# Altium schematic sheet OBD.SchDoc (part 1 of 3)
size A3
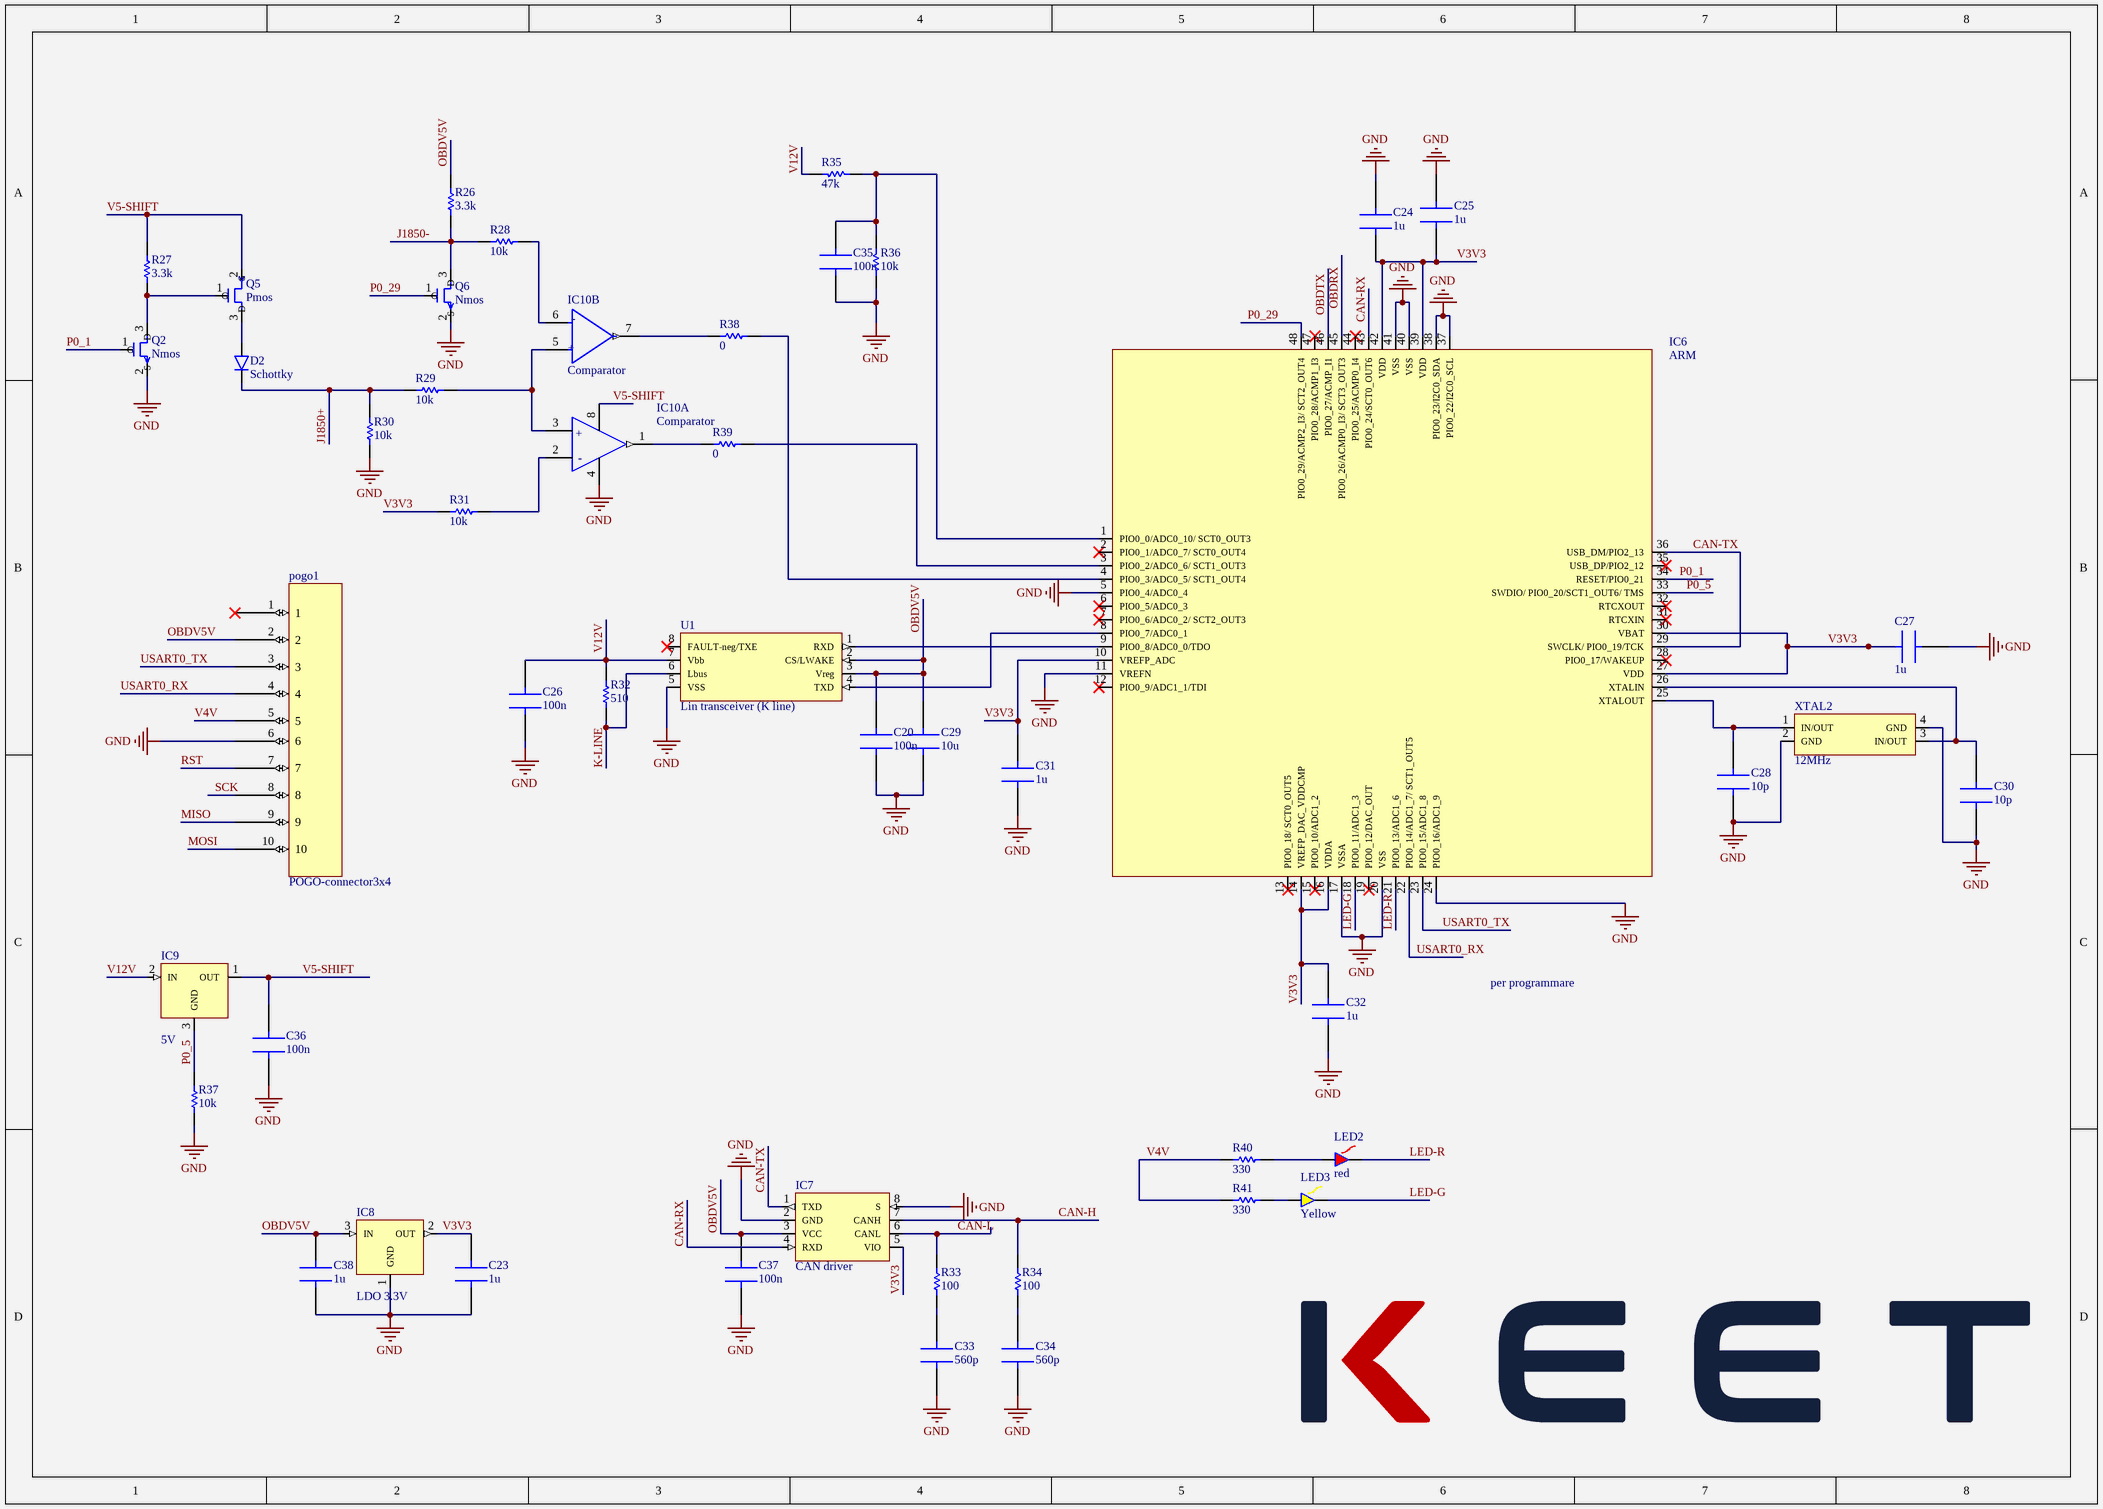
[diagram p0: OBD.SchDoc]

## Parts
C20  100n  [CAPC1005X06N]
C23  1u  [CAPC1005X06N]
C24  1u  [CAPC1005X06N]
C25  1u  [CAPC1005X06N]
C26  100n  [CAPC1005X06N]
C27  1u  [CAPC1005X06N]
C28  10p  [CAPC1005X06N]
C29  10u  [CAPC1005X06N]
C30  10p  [CAPC1005X06N]
C31  1u  [CAPC1005X06N]
C32  1u  [CAPC1005X06N]
C33  560p  [CAPC1005X06N]
C34  560p  [CAPC1005X06N]
C35  100n  [CAPC1005X06N]
C36  100n  [CAPC1005X06N]
C37  100n  [CAPC1005X06N]
C38  1u  [CAPC1005X06N]
D2  Schottky  [TSSOP0P370X135-2N]
IC6  ARM  [TSQFP50P898X898X160-48N]
IC7  CAN driver  [SOP127P600X175-8N]
IC8  LDO 3.3V  [SOT95P240X135-3N]
IC9  5V  [SOT95P237X111-3N-ver2]
IC10  Comparator  [SOIC127P600X175-8N]  (parts A,B of 2)
LED2  red  [CAC-0P80X160-2N_ver2]
LED3  Yellow  [CAC-0P80X160-2N_ver2]
pogo1  POGO-connector3x4  [POGO_connector_3x4]
Q2  Nmos  [SOT95P240X135-3N]
Q5  Pmos  [SOT95P237X111-3N]
Q6  Nmos  [SOT95P240X135-3N]
R26  3.3k  [RESC1005X04N]
R27  3.3k  [RESC1005X04N]
R28  10k  [RESC1005X04N]
R29  10k  [RESC1005X04N]
R30  10k  [RESC1005X04N]
R31  10k  [RESC1005X04N]
R32  510  [RESC1005X04N]
R33  100  [RESC1005X04N]
R34  100  [RESC1005X04N]
R35  47k  [RESC1005X04N]
R36  10k  [RESC1005X04N]
R37  10k  [RESC1005X04N]
R38  0  [RESC2012X06N]
R39  0  [RESC2012X06N]
R40  330  [RESC1005X04N]
R41  330  [RESC1005X04N]
U1  Lin transceiver (K line)  [SOP127P600X175-8N]
XTAL2  12MHz  [DFN170P250X60-4N]

## Nets
GND: C20.1 C23.2 C24.2 C25.2 C26.1 C27.2 C28.1 C29.1 C30.1 C31.2 C32.1 C33.2 C34.2 C35.1 C36.1 C37.1 C38.2 IC6.5(PIO0_4/ADC0_4) IC6.11(VREFN) IC6.17(VSSA) IC6.20(VSS) IC6.24(PIO0_16/ADC1_9) IC6.37(PIO0_22/I2C0_SCL) IC6.38(PIO0_23/I2C0_SDA) IC6.40(VSS) IC6.41(VSS) IC7.2(GND) IC7.8(S) IC8.1(GND) IC10.4(Vcc-) pogo1.6 Q2.2(S) Q6.2(S) R30.1 R36.1 R37.1 U1.5(VSS) XTAL2.2(GND) XTAL2.4(GND)
CAN-H: IC7.7(CANH) R34.2
CAN-L: IC7.6(CANL) R33.2
CAN-RX: IC6.43(PIO0_24/SCT0_OUT6) IC7.4(RXD)
CAN-TX: IC6.29(SWCLK/_PIO0_19/TCK) IC6.36(USB_DM/PIO2_13) IC7.1(TXD)
J1850+: D2.2(K) R29.1 R30.2
J1850-: Q6.3(D) R26.1 R28.1
K-LINE: R32.1 U1.6(Lbus)
LED-G: IC6.18(PIO0_11/ADC1_3) LED3.1(K)
LED-R: IC6.21(PIO0_13/ADC1_6) LED2.1(K)
MISO: pogo1.9
MOSI: pogo1.10
OBDRX: IC6.45(PIO0_26/ACMP0_I3/_SCT3_OUT3)
OBDTX: IC6.46(PIO0_27/ACMP_I1)
OBDV5V: C20.2 C29.2 C37.2 C38.1 IC7.3(VCC) IC8.3(IN) pogo1.2 R26.2 U1.2(CS/LWAKE) U1.3(Vreg)
P0_1: IC6.34(RESET/PIO0_21) Q2.1(G)
P0_5: IC6.33(SWDIO/_PIO0_20/SCT1_OUT6/_TMS) IC9.3(GND) R37.2
P0_29: IC6.48(PIO0_29/ACMP2_I3/_SCT2_OUT4) Q6.1(G)
RST: pogo1.7
SCK: pogo1.8
USART0_RX: IC6.22(PIO0_14/ADC1_7/_SCT1_OUT5) pogo1.4
USART0_TX: IC6.23(PIO0_15/ADC1_8) pogo1.3
V3V3: C23.1 C24.1 C25.1 C27.1 C31.1 C32.2 IC6.10(VREFP_ADC) IC6.14(VREFP_DAC_VDDCMP) IC6.16(VDDA) IC6.27(VDD) IC6.30(VBAT) IC6.39(VDD) IC6.42(VDD) IC7.5(VIO) IC8.2(OUT) R31.1
V4V: pogo1.5 R40.1 R41.1
V5-SHIFT: C36.2 IC9.1(OUT) IC10.8(Vcc+) Q5.2(S) R27.2
V12V: C26.2 IC9.2(IN) R32.2 R35.2 U1.7(Vbb)
NetC28_2: C28.2 IC6.25(XTALOUT) XTAL2.1(IN/OUT)
NetC30_2: C30.2 IC6.26(XTALIN) XTAL2.3(IN/OUT)
NetC33_1: C33.1 R33.1
NetC34_1: C34.1 R34.1
NetC35_2: C35.2 IC6.1(PIO0_0/ADC0_10/_SCT0_OUT3) R35.1 R36.2
NetD2_1: D2.1(A) Q5.3(D)
NetIC6_3: IC6.3(PIO0_2/ADC0_6/_SCT1_OUT3) R39.2
NetIC6_4: IC6.4(PIO0_3/ADC0_5/_SCT1_OUT4) R38.2
NetIC6_8: IC6.8(PIO0_7/ADC0_1) U1.4(TXD)
NetIC6_9: IC6.9(PIO0_8/ADC0_0/TDO) U1.1(RXD)
NetIC10_1: IC10.1(Out1) R39.1
NetIC10_2: IC10.2(In1-) R31.2
NetIC10_3: IC10.3(In1+) IC10.5(In2+) R29.2
NetIC10_6: IC10.6(In2-) R28.2
NetIC10_7: IC10.7(Out2) R38.1
NetLED2_2: LED2.2(A) R40.2
NetLED3_2: LED3.2(A) R41.2
NetQ2_3: Q2.3(D) Q5.1(G) R27.1

Not connected (* = marked no-connect by the designer): IC6 2(PIO0_1/ADC0_7/_SCT0_OUT4)* 6(PIO0_5/ADC0_3)* 7(PIO0_6/ADC0_2/_SCT2_OUT3)* 12(PIO0_9/ADC1_1/TDI)* 13(PIO0_18/_SCT0_OUT5)* 15(PIO0_10/ADC1_2)* 19(PIO0_12/DAC_OUT)* 28(PIO0_17/WAKEUP)* 31(RTCXIN)* 32(RTCXOUT)* 35(USB_DP/PIO2_12)* 44(PIO0_25/ACMP0_I4)* 47(PIO0_28/ACMP1_I3)*; pogo1 1*; U1 8(FAULT-neg/TXE)*

## Notes on the sheet
- per programmare
- (in symbol LM393D, part A) +; -
- (in symbol LM393D, part B) -; +